# Altium schematic sheet PWM_Soldeerbout.SchDoc: Soldeerstation
size A4; DrawnBy: Jonas Vanhulst; DocumentNumber: 5/5; Revision: V1.0; SheetNumber: 3; SheetTotal: 4; Number: PXL_EAI_1001
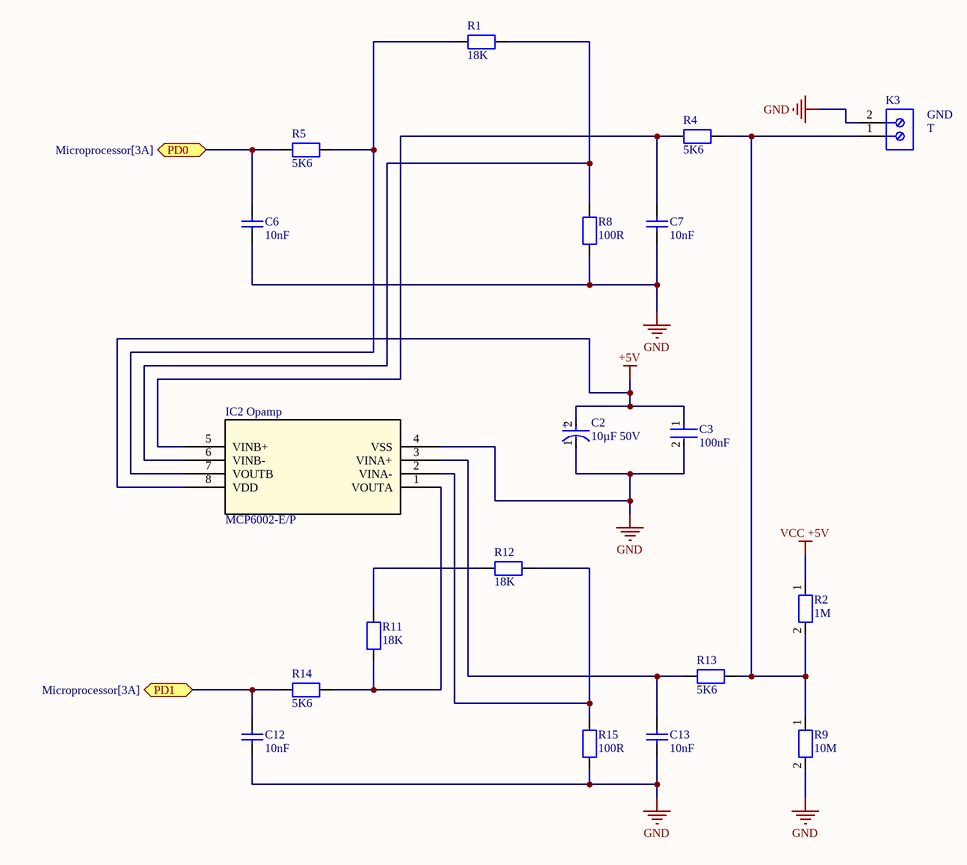
[diagram p0: PWM_Soldeerbout.SchDoc]

## Parts
C2  10µF 50V  [cap 10µF 50V]
C3  100nF  [FP-C0805C-DN-IPC_A]
C6  10nF  [FP-C0805C-DN-IPC_A]
C7  10nF  [FP-C0805C-DN-IPC_A]
C12  10nF  [FP-C0805C-DN-IPC_A]
C13  10nF  [FP-C0805C-DN-IPC_A]
IC2_Opamp  MCP6002-E/P  [8pin Socket]
K3  (no value)  [2pin connector]
R1  18K  [Weerstand 1M ohm]
R2  1M  [Weerstand 1M ohm]
R4  5K6  [Weerstand 1M ohm]
R5  5K6  [Weerstand 1M ohm]
R8  100R  [Weerstand 1M ohm]
R9  10M  [Weerstand 1M ohm]
R11  18K  [Weerstand 1M ohm]
R12  18K  [Weerstand 1M ohm]
R13  5K6  [Weerstand 1M ohm]
R14  5K6  [Weerstand 1M ohm]
R15  100R  [Weerstand 1M ohm]

## Ports
PD0 (bidir, see Microprocessor[3A]), PD1 (bidir, see Microprocessor[3A])

## Nets
+5V: C2.2(A) C3.1 IC2_Opamp.8(VDD)
GND: C2.1(C) C3.2 C6.1 C7.1 C12.1 C13.1 IC2_Opamp.4(VSS) K3.2 R8.1 R9.2 R15.1
VCC +5V: R2.1
PD0: C6.2 R5.1 ; port PD0
PD1: C12.2 R14.1 ; port PD1
NetC7_2: C7.2 IC2_Opamp.5(VINB+) R4.1
NetC13_2: C13.2 IC2_Opamp.3(VINA+) R13.1
NetIC2_Opamp_1: IC2_Opamp.1(VOUTA) R11.1 R14.2
NetIC2_Opamp_2: IC2_Opamp.2(VINA-) R12.2 R15.2
NetIC2_Opamp_6: IC2_Opamp.6(VINB-) R1.2 R8.2
NetIC2_Opamp_7: IC2_Opamp.7(VOUTB) R1.1 R5.2
NetK3_1: K3.1 R2.2 R4.2 R9.1 R13.2
NetR11_2: R11.2 R12.1

## Notes on the sheet
- (near K3) GND
- (near K3) T
- (in symbol 10µF 50V) +

## Library data of the parts
C2 = 10µF 50V: Aluminum Electrolytic Capacitors (Radial Lead Type) 10uF ±20% 50V; Lead Diameter: 0.5mm; Life (Hours): 5000Hour; Impedance: 340mR; Ripple Current (AC): 250mA; REACH SVHC: Yes; Tolerance: 20%; Construction: RADIAL; Min Operating Temperature: -40°C; Termination: Radial; Voltage Rating: 50V; Height: 11mm; Max Operating Temperature: 105°C; Capacitance: 10uF; Voltage: 50V; Diameter: 5mm; Lead Pitch: 2mm; Series: FR Radial; RoHS Compliant: Yes; Case/Package: Radial
C3 = cap 50V 100nF: Chip Multilayer Ceramic Capacitors for Automotive, 0805, 0.10uF, X7R, 15%, 10%, 50V, Grade 1; Case Code (Metric): 2012; Voltage Rating: 50V; Height: 1.25mm; Weight: 0.000335oz; Mount: Surface Mount; Width: 0.049inch; Packaging: Tape and Reel; Min Operating Temperature: -55°C; Depth: 1.25mm; Length: 2mm; Max Operating Temperature: 125°C; Ratings: AEC-Q200; Termination: SMD/SMT; Capacitance: 100nF; Thickness: 0.049inch; Case/Package: 0805; Voltage Rating (DC): 50V; Dielectric: X7R; Case Code (Imperial): 0805; Tolerance: 10%; Package Quantity: 3000
C6 C7 C12 C13 = cap 10nF X7R 50V: Part Number: VJ0805Y103KXACW1BC; Manufacturer: Vitramon
IC2_Opamp = MCP6002-E/P: No Description Available; Mfr_Name: Microchip; Copyright: Copyright (C) 2023 Ultra Librarian. All rights reserved.; Manufacturer_Part_Number: MCP6002-E/P; RefDes: RefDes; Type: DEV
K3 = Printkroonsteen 2pin: PC Terminal Block, Pitch 6.35 mm, 1 x 2 Position, Height 21.5 mm, Tail Lenght 5.1 mm, RoHS, Bulk; Manufacturer: Phoenix Contact; Package Description: PC Terminal Block, Pitch 6.35 mm, 1 x 2 Position, Height 21.5 mm, Tail Lenght 5.1 mm; Datasheet URL: http://media.digikey.com/pdf/Data%20Sheets/Phoenix%20Contact%20PDFs/1714955.pdf; Package Reference: 1714955; Manufacturer URL: http://www.phoenixcontact.com/; Datasheet Version: 02/2010; Mounting Technology: ThroughHole
R1 R11 R12 = Weerstand 18kohm: Part Number: CRCW080518K0FKEA; Manufacturer: Vishay Dale
R2 = Weerstand 1M ohm: RES Thick Film, 1MΩ, 1%, 0.125W, 100ppm/°C, 0805; Voltage Rating (DC): 150V; Resistance: 1MR; Power Rating: 125mW; Packaging: Tape and Reel; Case Code (Metric): 2012; Case/Package: 0805; Width: 1.25mm; Mount: Surface Mount; Military Standard: Not; Radiation Hardening: No; Weight: 0.000194oz; Package Quantity: 5000; Max Operating Temperature: 155°C; Contact Plating: Tin; Composition: Thick Film; Number of Pins: 2; Tolerance: 1%; Termination: SMD/SMT; Case Code (Imperial): 0805; Depth: 1.25mm; Temperature Coefficient: 100ppm/°C; Min Operating Temperature: -55°C; Height: 0.45mm; Lead Free: Lead Free; Length: 2mm; Voltage Rating: 150V
R4 R5 R13 R14 = Weerstand 5K6: 5K6 0.125W 5% 0805 (2012 Metric)  SMD; Value: 5600.00 Ohm; Case-EIA: 0805; Case-Metric: 2012; Tolerance: 5 %; Power: 0.125 W; Technology: SMT
R8 R15 = Weerstand 100 ohm: Manufacturer: Vishay Dale; Part Number: CRCW0805100RFKEA
R9 = Weerstand 10M ohm: RES Thick Film, 10MΩ, 1%, 0.125W, 100ppm/°C, 0805; Power Rating: 125mW; Voltage Rating (DC): 150V; Tolerance: 5%; Resistance: 10MR; Contact Plating: Tin; Composition: Thick Film; Length: 2mm; Weight: 0.000194oz; Case Code (Metric): 2012; Voltage Rating: 150V; Package Quantity: 10; Height: 0.02inch; Case Code (Imperial): 0805; Lead Free: Lead Free; Depth: 1.25mm; Min Operating Temperature: -55°C; Max Power Dissipation: 125mW; Temperature Coefficient: 100ppm/°C; Mount: Surface Mount; Features: Automotive AEC-Q200; Termination: SMD/SMT; Max Operating Temperature: 155°C; Radiation Hardening: No; Case/Package: 0805; Width: 0.049inch; Military Standard: Not; Number of Terminations: 2; Packaging: Tape and Reel